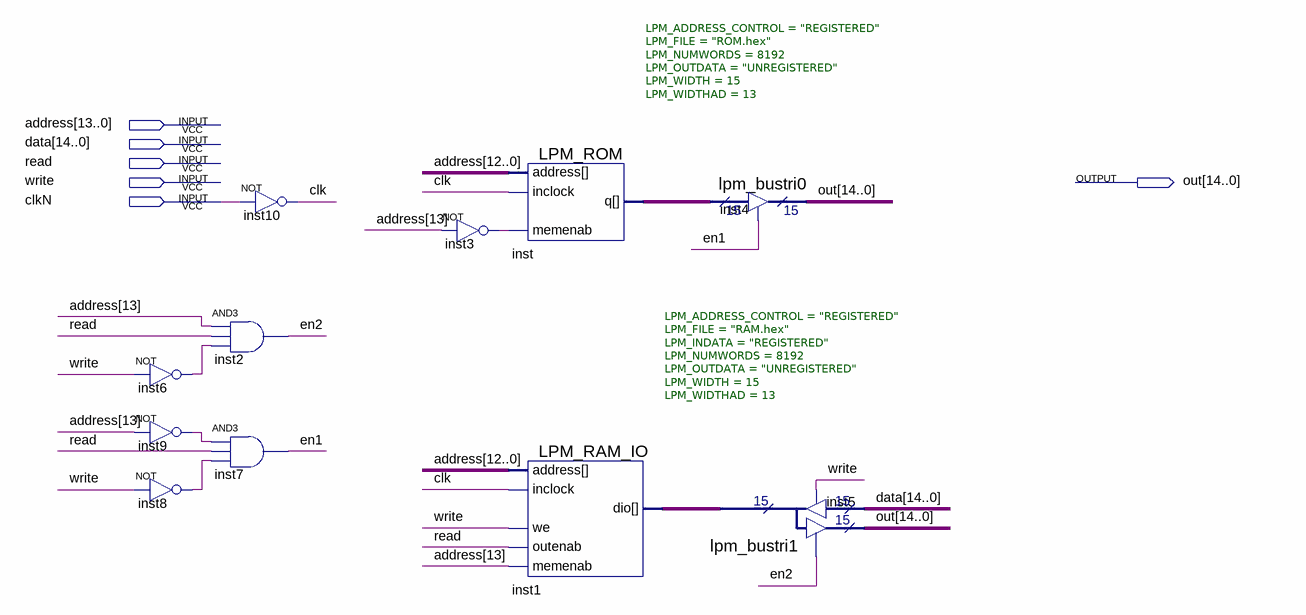
[diagram p0: schematic sheet]
// Quartus schematic memory.bdf as structural Verilog: 11 symbols, 6 pins
module memory (
  input  [13:0] address,
  input  [14:0] data,
  input  read,
  input  write,
  input  clkN,
  output [14:0] out
);

  wire clk, en1, en2, inst3_out, inst6_out, inst8_out, inst9_out;
  wire [14:0] inst1_dio, inst_q;

  not inst6 (inst6_out, write);
  not inst9 (inst9_out, address[13]);
  not inst8 (inst8_out, write);
  and inst2 (en2, address[13], read, inst6_out);
  and inst7 (en1, inst9_out, read, inst8_out);
  not inst10 (clk, clkN);
  not inst3 (inst3_out, address[13]);
  LPM_ROM #(.LPM_ADDRESS_CONTROL("REGISTERED"), .LPM_FILE("ROM.hex"), .LPM_NUMWORDS(8192), .LPM_OUTDATA("UNREGISTERED"), .LPM_WIDTH(15), .LPM_WIDTHAD(13)) inst (
    .address(address[12:0]), .inclock(clk), .memenab(inst3_out), .q(inst_q));
  LPM_RAM_IO #(.LPM_ADDRESS_CONTROL("REGISTERED"), .LPM_FILE("RAM.hex"), .LPM_INDATA("REGISTERED"), .LPM_NUMWORDS(8192), .LPM_OUTDATA("UNREGISTERED"), .LPM_WIDTH(15), .LPM_WIDTHAD(13)) inst1 (
    .address(address[12:0]), .memenab(address[13]), .inclock(clk), .we(write), .outenab(read), .dio(inst1_dio));
  lpm_bustri0 inst4 (.enabledt(en1), .data(inst_q), .tridata(out));
  lpm_bustri1 inst5 (.enabledt(write), .data(data), .enabletr(en2), .result(out), .tridata(inst1_dio));
endmodule
